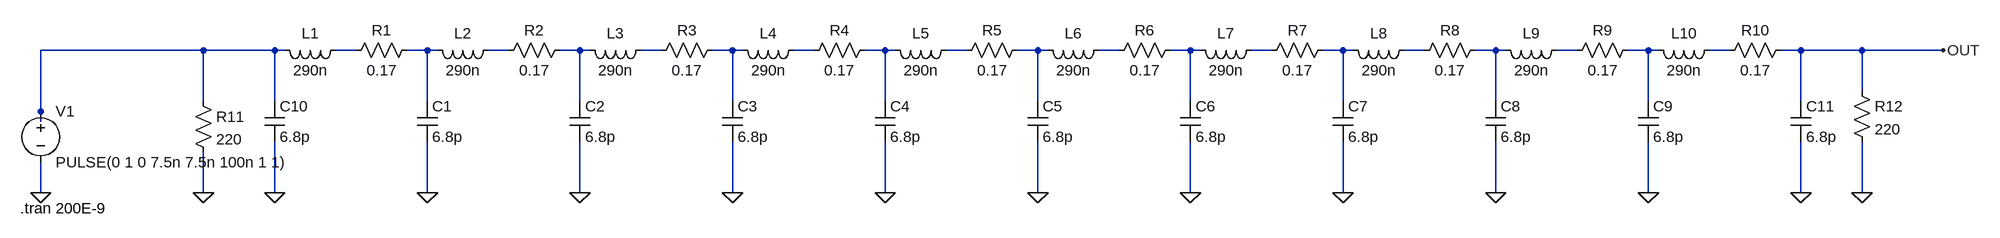
[diagram p0: schematic 10cell.asc]
10cell.asc, the LTspice schematic file:
Version 4
SHEET 1 1684 680
WIRE -1328 48 -1584 48
WIRE -1216 48 -1328 48
WIRE -1200 48 -1216 48
WIRE -1088 48 -1120 48
WIRE -976 48 -1008 48
WIRE -960 48 -976 48
WIRE -848 48 -880 48
WIRE -736 48 -768 48
WIRE -720 48 -736 48
WIRE -608 48 -640 48
WIRE -496 48 -528 48
WIRE -480 48 -496 48
WIRE -368 48 -400 48
WIRE -256 48 -288 48
WIRE -240 48 -256 48
WIRE -128 48 -160 48
WIRE -16 48 -48 48
WIRE 0 48 -16 48
WIRE 112 48 80 48
WIRE 224 48 192 48
WIRE 240 48 224 48
WIRE 352 48 320 48
WIRE 464 48 432 48
WIRE 480 48 464 48
WIRE 592 48 560 48
WIRE 704 48 672 48
WIRE 720 48 704 48
WIRE 832 48 800 48
WIRE 944 48 912 48
WIRE 960 48 944 48
WIRE 1072 48 1040 48
WIRE 1184 48 1152 48
WIRE 1280 48 1184 48
WIRE 1408 48 1280 48
WIRE 1280 112 1280 48
WIRE -1328 128 -1328 48
WIRE -1216 128 -1216 48
WIRE -976 128 -976 48
WIRE -736 128 -736 48
WIRE -496 128 -496 48
WIRE -256 128 -256 48
WIRE -16 128 -16 48
WIRE 224 128 224 48
WIRE 464 128 464 48
WIRE 704 128 704 48
WIRE 944 128 944 48
WIRE 1184 128 1184 48
WIRE -1584 144 -1584 48
WIRE -1584 160 -1584 144
WIRE -1584 272 -1584 224
WIRE -1328 272 -1328 208
WIRE -1216 272 -1216 192
WIRE -976 272 -976 192
WIRE -736 272 -736 192
WIRE -496 272 -496 192
WIRE -256 272 -256 192
WIRE -16 272 -16 192
WIRE 224 272 224 192
WIRE 464 272 464 192
WIRE 704 272 704 192
WIRE 944 272 944 192
WIRE 1184 272 1184 192
WIRE 1280 272 1280 192
FLAG -1584 272 0
FLAG -1216 272 0
FLAG -976 272 0
FLAG -736 272 0
FLAG -496 272 0
FLAG -256 272 0
FLAG -16 272 0
FLAG 224 272 0
FLAG 464 272 0
FLAG 704 272 0
FLAG 944 272 0
FLAG -1328 272 0
FLAG 1184 272 0
FLAG 1280 272 0
FLAG 1408 48 OUT
SYMBOL voltage -1584 128 R0
WINDOW 123 0 0 Left 0
WINDOW 39 0 0 Left 0
SYMATTR InstName V1
SYMATTR Value PULSE(0 1 0 7.5n 7.5n 100n 1 1)
SYMBOL ind -1104 32 R90
WINDOW 0 5 56 VBottom 2
WINDOW 3 32 56 VTop 2
SYMATTR InstName L1
SYMATTR Value 290n
SYMBOL res -992 32 R90
WINDOW 0 0 56 VBottom 2
WINDOW 3 32 56 VTop 2
SYMATTR InstName R1
SYMATTR Value 0.17
SYMBOL cap -992 128 R0
SYMATTR InstName C1
SYMATTR Value 6.8p
SYMBOL ind -864 32 R90
WINDOW 0 5 56 VBottom 2
WINDOW 3 32 56 VTop 2
SYMATTR InstName L2
SYMATTR Value 290n
SYMBOL res -752 32 R90
WINDOW 0 0 56 VBottom 2
WINDOW 3 32 56 VTop 2
SYMATTR InstName R2
SYMATTR Value 0.17
SYMBOL cap -752 128 R0
SYMATTR InstName C2
SYMATTR Value 6.8p
SYMBOL ind -624 32 R90
WINDOW 0 5 56 VBottom 2
WINDOW 3 32 56 VTop 2
SYMATTR InstName L3
SYMATTR Value 290n
SYMBOL res -512 32 R90
WINDOW 0 0 56 VBottom 2
WINDOW 3 32 56 VTop 2
SYMATTR InstName R3
SYMATTR Value 0.17
SYMBOL cap -512 128 R0
SYMATTR InstName C3
SYMATTR Value 6.8p
SYMBOL ind -384 32 R90
WINDOW 0 5 56 VBottom 2
WINDOW 3 32 56 VTop 2
SYMATTR InstName L4
SYMATTR Value 290n
SYMBOL res -272 32 R90
WINDOW 0 0 56 VBottom 2
WINDOW 3 32 56 VTop 2
SYMATTR InstName R4
SYMATTR Value 0.17
SYMBOL cap -272 128 R0
SYMATTR InstName C4
SYMATTR Value 6.8p
SYMBOL ind -144 32 R90
WINDOW 0 5 56 VBottom 2
WINDOW 3 32 56 VTop 2
SYMATTR InstName L5
SYMATTR Value 290n
SYMBOL res -32 32 R90
WINDOW 0 0 56 VBottom 2
WINDOW 3 32 56 VTop 2
SYMATTR InstName R5
SYMATTR Value 0.17
SYMBOL cap -32 128 R0
SYMATTR InstName C5
SYMATTR Value 6.8p
SYMBOL ind 96 32 R90
WINDOW 0 5 56 VBottom 2
WINDOW 3 32 56 VTop 2
SYMATTR InstName L6
SYMATTR Value 290n
SYMBOL res 208 32 R90
WINDOW 0 0 56 VBottom 2
WINDOW 3 32 56 VTop 2
SYMATTR InstName R6
SYMATTR Value 0.17
SYMBOL cap 208 128 R0
SYMATTR InstName C6
SYMATTR Value 6.8p
SYMBOL ind 336 32 R90
WINDOW 0 5 56 VBottom 2
WINDOW 3 32 56 VTop 2
SYMATTR InstName L7
SYMATTR Value 290n
SYMBOL res 448 32 R90
WINDOW 0 0 56 VBottom 2
WINDOW 3 32 56 VTop 2
SYMATTR InstName R7
SYMATTR Value 0.17
SYMBOL cap 448 128 R0
SYMATTR InstName C7
SYMATTR Value 6.8p
SYMBOL ind 576 32 R90
WINDOW 0 5 56 VBottom 2
WINDOW 3 32 56 VTop 2
SYMATTR InstName L8
SYMATTR Value 290n
SYMBOL res 688 32 R90
WINDOW 0 0 56 VBottom 2
WINDOW 3 32 56 VTop 2
SYMATTR InstName R8
SYMATTR Value 0.17
SYMBOL cap 688 128 R0
SYMATTR InstName C8
SYMATTR Value 6.8p
SYMBOL ind 816 32 R90
WINDOW 0 5 56 VBottom 2
WINDOW 3 32 56 VTop 2
SYMATTR InstName L9
SYMATTR Value 290n
SYMBOL res 928 32 R90
WINDOW 0 0 56 VBottom 2
WINDOW 3 32 56 VTop 2
SYMATTR InstName R9
SYMATTR Value 0.17
SYMBOL cap 928 128 R0
SYMATTR InstName C9
SYMATTR Value 6.8p
SYMBOL ind 1056 32 R90
WINDOW 0 5 56 VBottom 2
WINDOW 3 32 56 VTop 2
SYMATTR InstName L10
SYMATTR Value 290n
SYMBOL res 1168 32 R90
WINDOW 0 0 56 VBottom 2
WINDOW 3 32 56 VTop 2
SYMATTR InstName R10
SYMATTR Value 0.17
SYMBOL res -1344 112 R0
SYMATTR InstName R11
SYMATTR Value 220
SYMBOL cap -1232 128 R0
SYMATTR InstName C10
SYMATTR Value 6.8p
SYMBOL cap 1168 128 R0
SYMATTR InstName C11
SYMATTR Value 6.8p
SYMBOL res 1264 96 R0
SYMATTR InstName R12
SYMATTR Value 220
TEXT -1616 296 Left 2 !.tran 200E-9

The netlist it stands for:
* 10cell.asc
V1 N001 0 PULSE(0 1 0 7.5n 7.5n 100n 1 1)
L1 N002 N001 290n
R1 N003 N002 0.17
C1 N003 0 6.8p
L2 N004 N003 290n
R2 N005 N004 0.17
C2 N005 0 6.8p
L3 N006 N005 290n
R3 N007 N006 0.17
C3 N007 0 6.8p
L4 N008 N007 290n
R4 N009 N008 0.17
C4 N009 0 6.8p
L5 N010 N009 290n
R5 N011 N010 0.17
C5 N011 0 6.8p
L6 N012 N011 290n
R6 N013 N012 0.17
C6 N013 0 6.8p
L7 N014 N013 290n
R7 N015 N014 0.17
C7 N015 0 6.8p
L8 N016 N015 290n
R8 N017 N016 0.17
C8 N017 0 6.8p
L9 N018 N017 290n
R9 N019 N018 0.17
C9 N019 0 6.8p
L10 N020 N019 290n
R10 OUT N020 0.17
R11 N001 0 220
C10 N001 0 6.8p
C11 OUT 0 6.8p
R12 OUT 0 220
.tran 200E-9
.backanno
.end